# Altium schematic sheet TEMP.SchDoc
size 420 x 297 mm; SheetNumber: 15; SheetTotal: 23
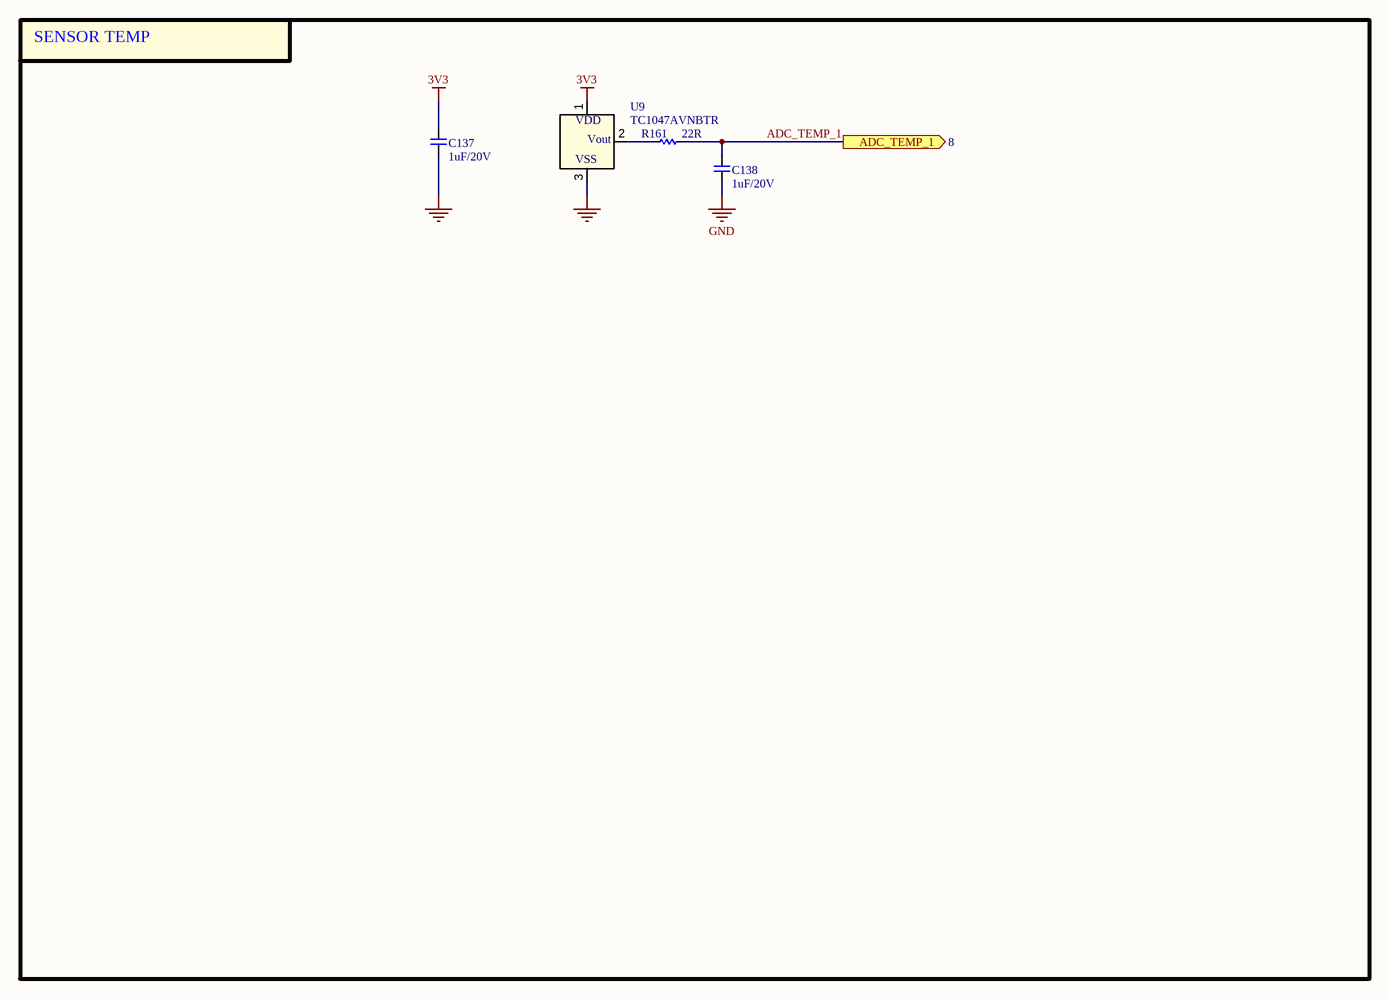
[diagram p0: TEMP.SchDoc]

## Parts
C137  1uF/20V  [CAP_C_1005X50_L]
C138  1uF/20V  [CAP_C_1005X50_L]
R161  22R  [RES_C_1005x30_L]
U9  TC1047AVNBTR  [SOT-23_MC_MCH]

## Blocks framed on the sheet
SENSOR TEMP: C137 C138 R161 U9

## Ports
ADC_TEMP_1 (out, see 8)

## Nets
3V3: C137.2 U9.1(VDD)
GND: C137.1 C138.1 U9.3(VSS)
ADC_TEMP_1: C138.2 R161.2 ; port ADC_TEMP_1
NetR161_1: R161.1 U9.2(VOUT)

## Notes on the sheet
- Project:
- BEE-1012
- Sub-system:
- SATELLITE_EXP_CONTROLLER
- Design by:
- SANG HUYNH
- BAO BUI
- Sheet title:
- Sheet
- A3
- of
- Checked by:
- Approved by:
- VU PHAM
- Revision:
- Document No:
- Size:
- Date:
- (in symbol TC1047AVNBTR) Vout

## Library data of the parts
C137 C138 = _CAP_C_2: CAP CHIP
R161 = _RES_B_2: RES
U9 = TC1047AVNBTR: SENSOR ANALOG -40C-125C SOT23-3; Manufacturer_Name: Microchip; Copyright: Copyright (C) 2025 Ultra Librarian. All rights reserved.; Manufacturer_Part_Number: TC1047AVNBTR; RefDes: RefDes; Type: Type